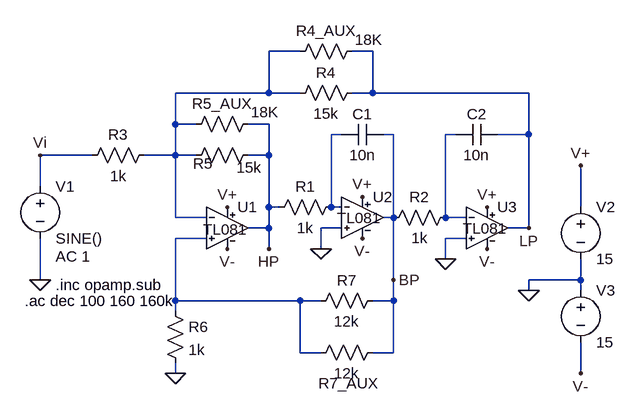
[diagram p0: schematic tpLab.asc]
tpLab.asc, the LTspice schematic file:
Version 4
SHEET 1 880 680
WIRE 288 -80 240 -80
WIRE 400 -80 368 -80
WIRE 240 -16 240 -80
WIRE 240 -16 96 -16
WIRE 288 -16 240 -16
WIRE 400 -16 400 -80
WIRE 400 -16 368 -16
WIRE 640 -16 400 -16
WIRE 96 32 96 -16
WIRE 128 32 96 32
WIRE 240 32 208 32
WIRE 352 48 336 48
WIRE 432 48 416 48
WIRE 528 48 512 48
WIRE 640 48 640 -16
WIRE 640 48 592 48
WIRE -32 80 -112 80
WIRE 96 80 96 32
WIRE 96 80 48 80
WIRE 128 80 96 80
WIRE 240 80 240 32
WIRE 240 80 208 80
WIRE -112 128 -112 80
WIRE 240 160 240 80
WIRE 256 160 240 160
WIRE 336 160 336 48
WIRE 352 160 336 160
WIRE 720 160 720 96
WIRE 96 176 96 80
WIRE 144 176 96 176
WIRE 432 176 432 48
WIRE 432 176 416 176
WIRE 512 176 512 48
WIRE 544 176 512 176
WIRE 240 192 240 160
WIRE 240 192 208 192
WIRE 352 192 320 192
WIRE 640 192 640 48
WIRE 640 192 608 192
WIRE 144 208 96 208
WIRE 544 208 512 208
WIRE 240 224 240 192
WIRE 320 224 320 192
WIRE 512 240 512 208
WIRE -112 272 -112 208
WIRE 432 272 432 176
WIRE 720 272 720 240
WIRE 720 272 640 272
WIRE 640 288 640 272
WIRE 720 288 720 272
WIRE 96 304 96 208
WIRE 288 304 96 304
WIRE 320 304 288 304
WIRE 432 304 432 272
WIRE 432 304 400 304
WIRE 96 320 96 304
WIRE 288 384 288 304
WIRE 320 384 288 384
WIRE 432 384 432 304
WIRE 432 384 400 384
WIRE 96 416 96 400
WIRE 720 416 720 368
FLAG -112 272 0
FLAG -112 80 Vi
FLAG 240 224 HP
FLAG 96 416 0
FLAG 320 224 0
FLAG 512 240 0
FLAG 640 192 LP
FLAG 432 272 BP
FLAG 720 96 V+
FLAG 176 160 V+
FLAG 384 144 V+
FLAG 576 160 V+
FLAG 720 416 V-
FLAG 176 224 V-
FLAG 384 208 V-
FLAG 576 224 V-
FLAG 640 288 0
SYMBOL res 352 144 R90
WINDOW 0 0 56 VBottom 2
WINDOW 3 32 56 VTop 2
SYMATTR InstName R1
SYMATTR Value 1k
SYMBOL res 528 160 R90
WINDOW 0 0 56 VBottom 2
WINDOW 3 32 56 VTop 2
SYMATTR InstName R2
SYMATTR Value 1k
SYMBOL res 64 64 R90
WINDOW 0 0 56 VBottom 2
WINDOW 3 32 56 VTop 2
SYMATTR InstName R3
SYMATTR Value 1k
SYMBOL cap 416 32 R90
WINDOW 0 0 32 VBottom 2
WINDOW 3 32 32 VTop 2
SYMATTR InstName C1
SYMATTR Value 10n
SYMBOL voltage -112 112 R0
WINDOW 123 24 124 Left 2
WINDOW 39 0 0 Left 0
SYMATTR Value2 AC 1
SYMATTR InstName V1
SYMATTR Value SINE()
SYMBOL res 384 -32 R90
WINDOW 0 0 56 VBottom 2
WINDOW 3 32 56 VTop 2
SYMATTR InstName R4
SYMATTR Value 15k
SYMBOL res 224 64 R90
WINDOW 0 44 85 VBottom 2
WINDOW 3 19 14 VTop 2
SYMATTR InstName R5
SYMATTR Value 15k
SYMBOL res 416 288 R90
WINDOW 0 0 56 VBottom 2
WINDOW 3 32 56 VTop 2
SYMATTR InstName R7
SYMATTR Value 12k
SYMBOL cap 592 32 R90
WINDOW 0 0 32 VBottom 2
WINDOW 3 32 32 VTop 2
SYMATTR InstName C2
SYMATTR Value 10n
SYMBOL res 80 304 R0
SYMATTR InstName R6
SYMATTR Value 1k
SYMBOL res 416 368 R90
WINDOW 0 79 53 VBottom 2
WINDOW 3 32 56 VTop 2
SYMATTR InstName R7_AUX
SYMATTR Value 12k
SYMBOL res 224 16 R90
WINDOW 0 0 56 VBottom 2
WINDOW 3 -18 -10 VTop 2
SYMATTR InstName R5_AUX
SYMATTR Value 18K
SYMBOL res 384 -96 R90
WINDOW 0 0 56 VBottom 2
WINDOW 3 -18 -10 VTop 2
SYMATTR InstName R4_AUX
SYMATTR Value 18K
SYMBOL AutoGenerated\\TL081 176 192 R0
WINDOW 3 -3 -13 Top 2
SYMATTR InstName U1
SYMBOL AutoGenerated\\TL081 384 176 R0
WINDOW 3 -5 -15 Top 2
SYMATTR InstName U2
SYMBOL AutoGenerated\\TL081 576 192 R0
WINDOW 3 -3 -15 Top 2
SYMATTR InstName U3
SYMBOL voltage 720 144 R0
SYMATTR InstName V2
SYMATTR Value 15
SYMBOL voltage 720 272 R0
SYMATTR InstName V3
SYMATTR Value 15
TEXT -88 280 Left 2 !.inc opamp.sub
TEXT -136 304 Left 2 !.ac dec 100 160 160k

The netlist it stands for:
* tpLab.asc
R1 N002 HP 1k
R2 N003 BP 1k
R3 N001 Vi 1k
C1 BP N002 10n
V1 Vi 0 SINE() AC 1
R4 LP N001 15k
R5 HP N001 15k
R7 BP N004 12k
C2 LP N003 10n
R6 N004 0 1k
R7_AUX BP N004 12k
R5_AUX HP N001 18K
R4_AUX LP N001 18K
XU1 N004 N001 V+ V- HP TL081  ; pins In+ In- V+ V- OUT
XU2 0 N002 V+ V- BP TL081  ; pins In+ In- V+ V- OUT
XU3 0 N003 V+ V- LP TL081  ; pins In+ In- V+ V- OUT
V2 V+ 0 15
V3 0 V- 15
.inc opamp.sub
.ac dec 100 160 160k
.lib Z:\home\pablo\Descargas\TL081.301
.backanno
.end